# EAGLE design PayloadStandingV9 (EAGLE 9.2.0)
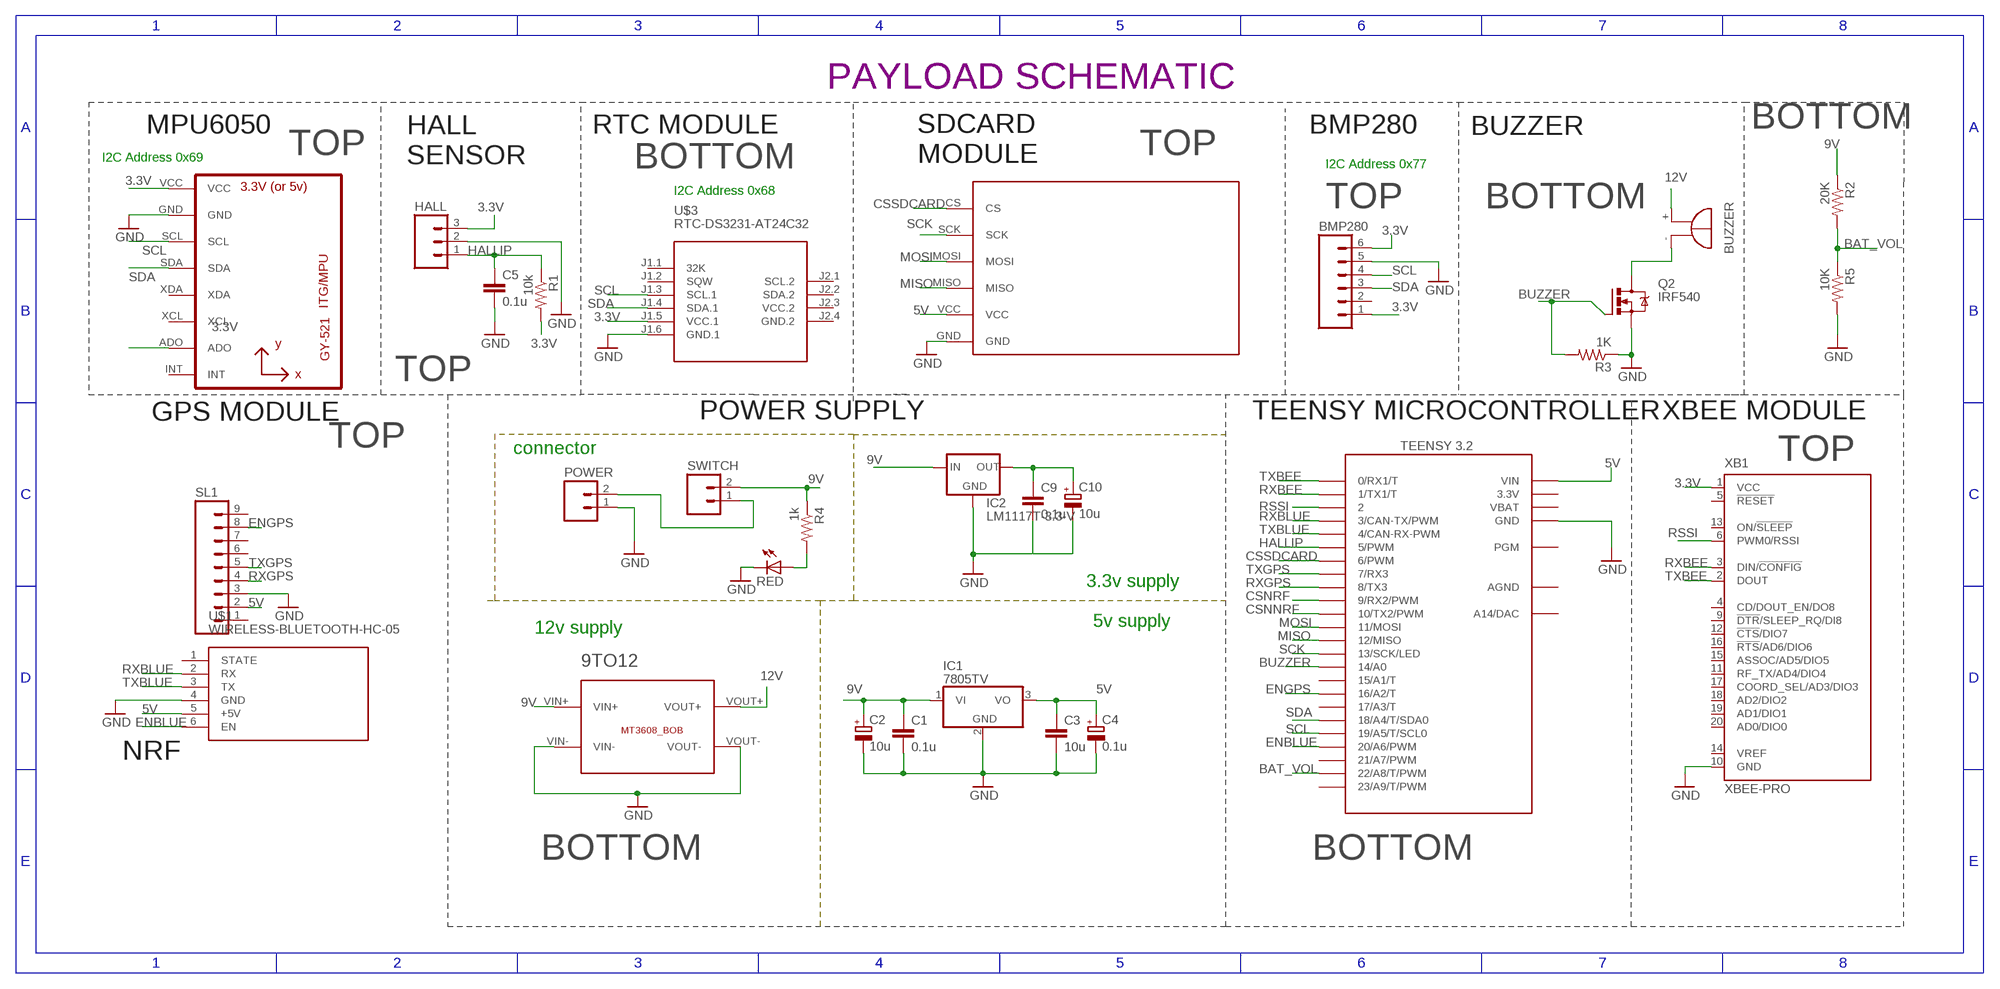
[diagram p0: schematic, sheet 1]

## Parts
9TO12  BREAKOUTS_MT3608_BOB  [BREAKOUTS_MT3608_BOB]
BMP280  M06  [06P]
C1  0.1u  C-EU025-025X050  [C025-025X050]
C2  10u  CPOL-EUE2.5-6  [E2,5-6]
C3  10u  C-EU025-025X050  [C025-025X050]
C4  0.1u  CPOL-EUE2.5-6  [E2,5-6]
C5  0.1u  C-EU025-025X050  [C025-025X050]
C9  0.1u  C-EU025-025X050  [C025-025X050]
C10  10u  CPOL-EUE2.5-6  [E2,5-6]
HALL  M03  [03P]
IC1  7805TV  [TO220V]
IC2  LM1117T-3.3-V  [TO220V]
POWER  CEDT_JANUARY_2015_V5_M02  [CEDT_JANUARY_2015_V5_02P]
Q2  IRF540  [TO220BV]
R1  10k  R-US_0204/7  [0204/7]
R2  20K  R-US_0204/7  [0204/7]
R3  1K  R-US_0204/7  [0204/7]
R4  1k  R-US_0204/7  [0204/7]
R5  10K  R-US_0204/7  [0204/7]
RED  red  LED3MM  [LED3MM]
SG1  BUZZER_EB2209A  [BUZZER_EB2209A]
SL1  M09  [09P]
SWITCH  M02  [02P]
U1  GY-521MPU6050  [GY-521]
U$1  WIRELESS-BLUETOOTH-HC-05  [WIRELESS-BLUETOOTH-HC-05]
U$2  TEENSY_3.1-3.2_OUTER_ROW  [TEENSY_3.0-3.2&LC_OUTER_ROW]
U$3  RTC-DS3231-AT24C32  [RTC-DS3231-AT24C32]
U$5  SDCARD  [M0SDCARDMODULE]
XB1  XBEE-PRO  [XBEE-PRO]

## Nets
3.3V [power]: BMP280.1 BMP280.6 C9.1 C10.+ HALL.3 IC2.2(OUT) R1.2 U1.ADO U1.VCC U$3.J1.5(VCC.1) XB1.1(VCC)
5V [power]: C3.1 C4.+ IC1.3(VO) SL1.2 U$1.5(+5V) U$2.VIN U$5.VCC
9V [power]: 9TO12.VIN+ C1.1 C2.+ IC1.1(VI) IC2.3(IN) R2.1 R4.1 SWITCH.2
12V [power]: 9TO12.VOUT+ SG1.+
BAT_VOL: R2.2 R5.1 U$2.22/A8(22/A8/T/PWM)
BUZZER: Q2.G R3.2 U$2.14/A0
CSNNRF: U$2.10(10/TX2/PWM)
CSNRF: U$2.9(9/RX2/PWM)
CSSDCARD: U$2.6(6/PWM) U$5.CS
ENBLUE: U$1.6(EN) U$2.20/A6(20/A6/PWM)
ENGPS: SL1.8 U$2.16/A2(16/A2/T)
GND [power]: 9TO12.VIN- 9TO12.VOUT- BMP280.5 C1.2 C2.- C3.2 C4.- C5.2 C9.2 C10.- HALL.2 IC1.2(GND) IC2.1(GND) POWER.1 Q2.S R3.1 R5.2 RED.K(C) SL1.3 U1.GND U$1.4(GND) U$2.GND U$2.GND1(GND) U$3.J1.6(GND.1) U$5.GND XB1.10(GND)
HALLIP: C5.1 HALL.1 R1.1 U$2.5(5/PWM)
MISO: U$2.12(12/MISO) U$5.MISO
MOSI: U$2.11(11/MOSI) U$5.MOSI
N$1 [power]: POWER.2 SWITCH.1
N$2: R4.2 RED.A
N$3 [power]: Q2.D SG1.-
RSSI: U$2.2 XB1.6(PWM0/RSSI)
RXBEE: U$2.1(1/TX1/T) XB1.3(DIN/!CONFIG)
RXBLUE: U$1.2(RX) U$2.3(3/CAN-TX/PWM)
RXGPS: SL1.4 U$2.8(8/TX3)
SCK: U$2.13(13/SCK/LED) U$5.SCK
SCL: BMP280.4 U1.SCL U$2.19/A5(19/A5/T/SCL0) U$3.J1.3(SCL.1)
SDA: BMP280.3 U1.SDA U$2.18/A4(18/A4/T/SDA0) U$3.J1.4(SDA.1)
TXBEE: U$2.0(0/RX1/T) XB1.2(DOUT)
TXBLUE: U$1.3(TX) U$2.4(4/CAN-RX-PWM)
TXGPS: SL1.5 U$2.7(7/RX3)
Unconnected: BMP280.2 SL1.1 SL1.6 SL1.7 SL1.9 U1.INT U1.XCL U1.XDA U$1.1(STATE) U$2.15/A1(15/A1/T) U$2.17/A3(17/A3/T) U$2.21/A7(21/A7/PWM) U$2.23/A9(23/A9/T/PWM) U$2.PGM U$2.RESET/DAC(A14/DAC) U$3.J1.1(32K) U$3.J1.2(SQW) U$3.J2.1(SCL.2) U$3.J2.2(SDA.2) XB1.4(CD/DOUT_EN/DO8) XB1.5(!RESET) XB1.9(!DTR!/SLEEP_RQ/DI8) XB1.11(RF_TX/AD4/DIO4) XB1.12(!CTS!/DIO7) XB1.13(ON/!SLEEP) XB1.14(VREF) XB1.15(ASSOC/AD5/DIO5) XB1.16(!RTS!/AD6/DIO6) XB1.17(COORD_SEL/AD3/DIO3) XB1.18(AD2/DIO2) XB1.19(AD1/DIO1) XB1.20(AD0/DIO0)

## Notes on the sheet
- PAYLOAD SCHEMATIC
- MPU6050 | RTC MODULE | BMP280 | BUZZER | BOTTOM
- TOP | TOP
- I2C Address 0x69
- SDCARD
  MODULE
- HALL
  SENSOR
- BOTTOM | I2C Address 0x77
- I2C Address 0x68
- TOP | BOTTOM
- TOP
- GPS MODULE | POWER SUPPLY | TEENSY MICROCONTROLLER | XBEE MODULE
- TOP
- connector
- TOP
- 3.3v supply
- 5v supply
- 12v supply
- NRF
- BOTTOM | BOTTOM

## Power pins joined to a net without a drawn wire
3.3V: U$2.3.3V U$2.3.3V1(3.3V)
AGND: U$2.AGND
GND.2: U$3.J2.4(GND.2)
VBAT: U$2.VBAT
VCC.2: U$3.J2.3(VCC.2)

## Library data of the parts
9TO12 = Cansat2019_3279_Container_v01:BREAKOUTS_MT3608_BOB
BMP280 = con-amp-quick:M06: AMP QUICK CONNECTOR; OC_FARNELL: unknown; OC_NEWARK: unknown
C1 C3 C5 C9 = resistor:C-EU: CAPACITOR, European symbol
C2 C4 C10 = rcl:CPOL-EU: POLARIZED CAPACITOR, European symbol; SPICEPREFIX: C
HALL = con-amp-quick:M03: AMP QUICK CONNECTOR; OC_FARNELL: unknown; OC_NEWARK: unknown
IC1 = linear:78*: Positive VOLTAGE REGULATOR Source: http://cache.national.com/ds/LM/LM78L05.pdf http://www.fairchildsemi.com/ds/LM/LM7805.pdf
IC2 = lm1117:LM1117T-*
POWER = Cansat2019_3279_Container_v01:CEDT_JANUARY_2015_V5_M02: AMP QUICK CONNECTOR
Q2 = transistor-power:IRF540: HEXFET Power MOSFET
R1-R5 = rcl:R-US_: RESISTOR, American symbol; SPICEPREFIX: R
RED = CEDT_JANUARY_2015_v5:LED
SG1 = Cansat2019_3279_Container_v01:BUZZER_EB2209A: BUZZER Source: Buerklin; OC_FARNELL: unknown; OC_NEWARK: unknown
SL1 = con-amp-quick:M09: AMP QUICK CONNECTOR; OC_FARNELL: unknown; OC_NEWARK: unknown
SWITCH = CEDT_JANUARY_2015_v5:M02: AMP QUICK CONNECTOR
U1 = gy-521:GY-521
U$1 = diy-modules(1):WIRELESS-BLUETOOTH-HC-05: Bluetooth Transceiver Module based on HC-05 board Tutorial is available here: https://arduino-info.wikispaces.com/BlueTooth-HC05-HC06-Modules-How-To Click here to find device on ebay.com <http://www.ebay.com/sch/hc-05+module+rs232>
U$2 = Teensy_3_and_LC_Series_Boards_v1.4:TEENSY_3.1-3.2_OUTER_ROW: Footprint for Teensy 3.1 or 3.2 board using all pin connections on the outer perimeter
U$3 = diy-modules:RTC-DS3231-AT24C32: RTC Module with Battery and EEPROM based on DS3231 and AT24C32 chips Tutorial can be found here: https://edwardmallon.wordpress.com/2014/05/21/using-a-cheap-3-ds3231-rtc-at24c32-eeprom-from-ebay/ Click here to find device on ebay.com <http://www.ebay.com/sch/DS3231+AT24C32+module>
U$5 = mylib:SDCARD
XB1 = maxstream:XBEE: XBee (TM) /XBee-PRO(TM) OEM RF Modules Source: MaxStream, Inc. xbee_productmanual.pdf; MPN: XBP24-AWI-001; OC_FARNELL: 1337916; OC_NEWARK: 42M2667

## Net classes
0 default: width 0.406 mm
1 power: width 0.61 mm

## Board
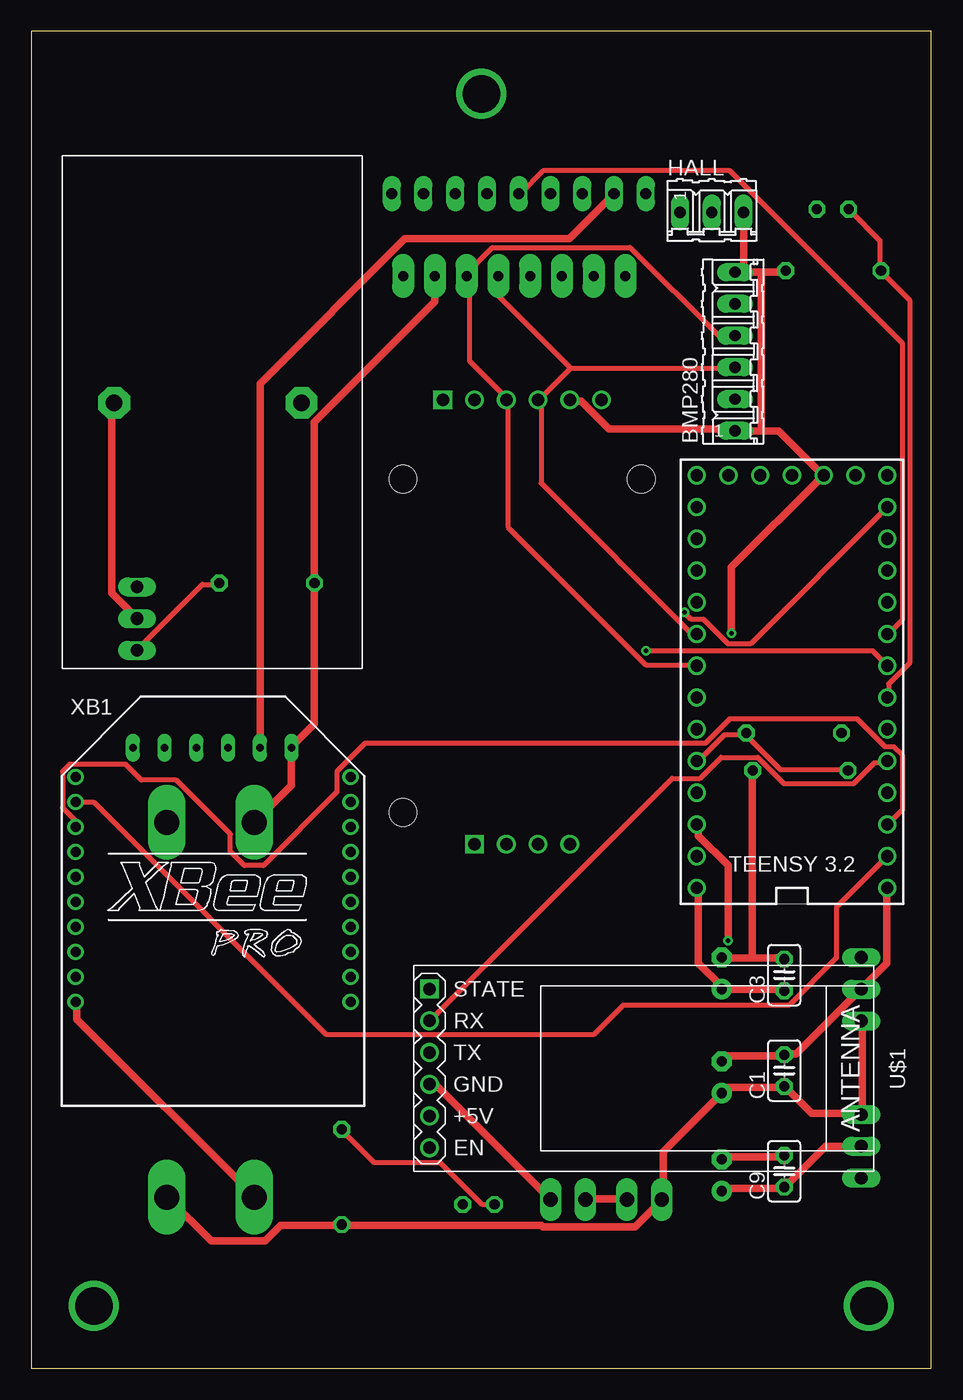
[diagram p1: board, top side]
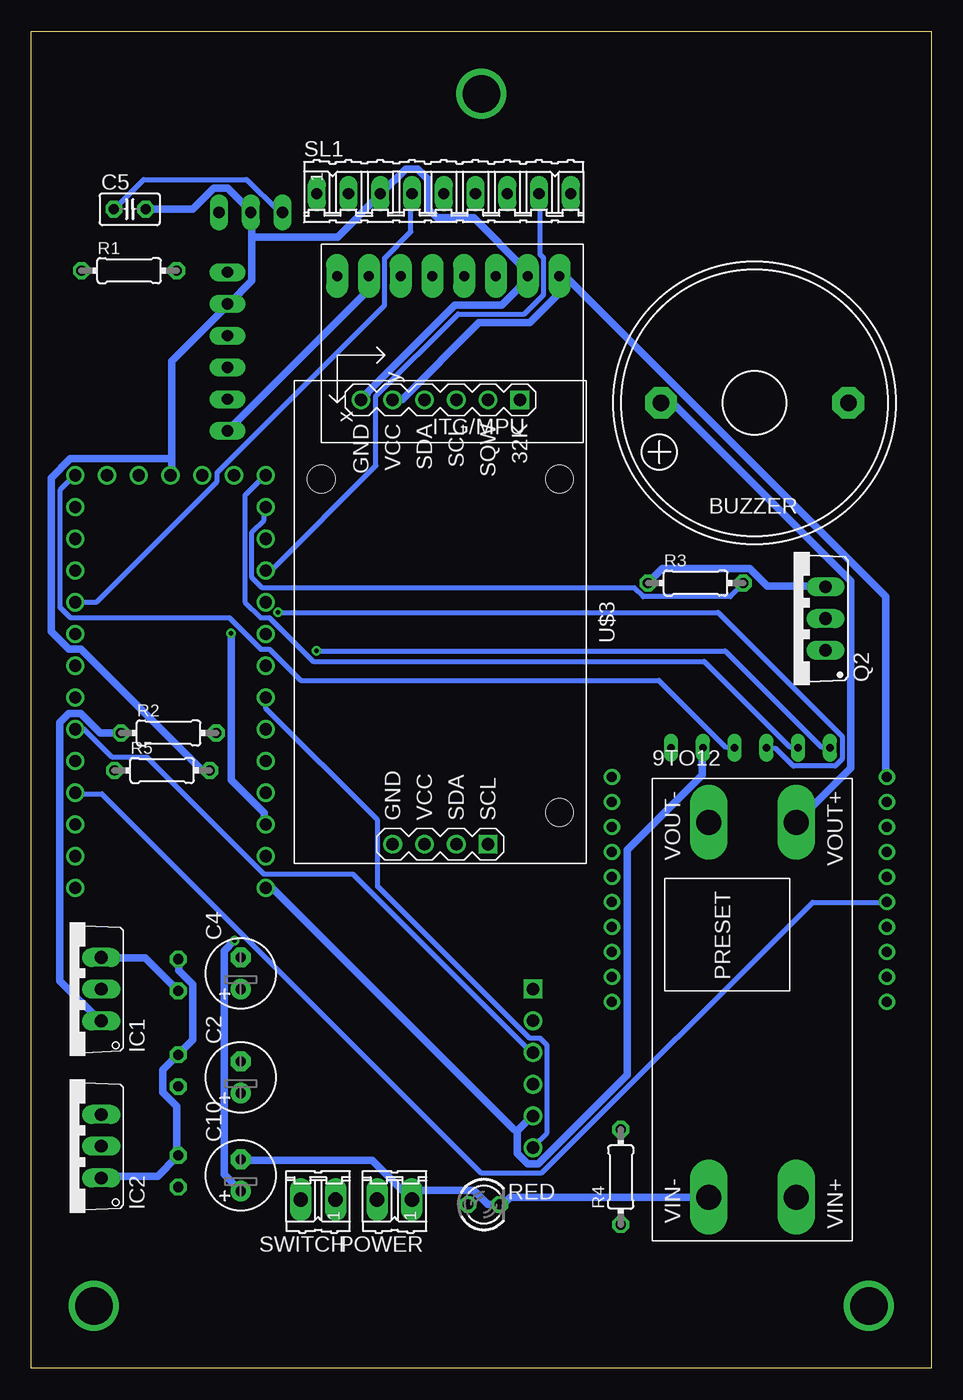
[diagram p2: board, bottom side, seen from below]

Size 72 x 107 mm. Coordinates in mm from the lower left corner, seen from the top.
Outline: 0,0 72,0 72,107 0,107 0,0
Copper layers (1*16): Top 0.035mm / dielectric 1.5mm / Bottom 0.035mm
Design rules "default": minimum track width 6mil, minimum drill 0.35mm, track to track 6mil, track to pad 6mil, pad to pad 6mil, via to via 6mil, smd to smd 6mil, copper to edge 40mil, drill to drill 6mil, minimum pad ring 10mil, minimum via ring 8mil, stop-mask expansion 4mil, vias tented up to drill 0mil, thermal gap 10mil

### Footprints (pad centres in the part's own frame; a part is rotated, then mirrored left to right if it is on the bottom)
BREAKOUTS_MT3608_BOB = drill 2 pad 3 long: VIN+ 33.5,-4.5; VIN- 33.5,-11.5; VOUT+ 3.5,-4.5; VOUT- 3.5,-11.5
06P = drill 0.914 long: 1 -6.35,0; 2 -3.81,0; 3 -1.27,0; 4 1.27,0; 5 3.81,0; 6 6.35,0
C025-025X050 = drill 0.813 octagon: 1 -1.27,0; 2 1.27,0
E2,5-6 = drill 0.813 pad 1.6: + -1.27,0 | drill 0.813 pad 1.6 octagon: - 1.27,0
03P = drill 0.914 long: 1 -2.54,0; 2 0,0; 3 2.54,0
TO220V = drill 1.016 long: 1 -2.54,-2.54; 2 0,-2.54; 3 2.54,-2.54
CEDT_JANUARY_2015_V5_02P = drill 1.143 long: 1 -1.397,0; 2 1.397,0
TO220BV = drill 1.016 long: D 0,-2.54; G -2.54,-2.54; S 2.54,-2.54
0204/7 = drill 0.813 octagon: 1 -3.81,0; 2 3.81,0
LED3MM = drill 0.813 octagon: A -1.27,0; K 1.27,0
BUZZER_EB2209A = drill 1.321 pad 2.54 octagon: + 7.493,0; - -7.493,0
09P = drill 0.914 long: 1 -10.16,0; 2 -7.62,0; 3 -5.08,0; 4 -2.54,0; 5 0,0; 6 2.54,0; 7 5.08,0; 8 7.62,0; 9 10.16,0
02P = drill 1.143 long: 1 -1.397,0; 2 1.397,0
GY-521 = drill 0.8 pad 1.778 long: ADO -8.89,-6.35; GND -8.89,6.35; INT -8.89,-8.89; SCL -8.89,3.81; SDA -8.89,1.27; VCC -8.89,8.89; XCL -8.89,-3.81; XDA -8.89,-1.27
WIRELESS-BLUETOOTH-HC-05 = drill 1 square: 1 -6.35,-17.145 | drill 1: 2 -3.81,-17.145; 3 -1.27,-17.145; 4 1.27,-17.145; 5 3.81,-17.145; 6 6.35,-17.145
TEENSY_3.0-3.2&LC_OUTER_ROW = drill 0.965: 0 -7.62,13.97; 1 -7.62,11.43; 2 -7.62,8.89; 3 -7.62,6.35; 3.3V 7.62,11.43; 3.3V1 -2.54,-16.51; 4 -7.62,3.81; 5 -7.62,1.27; 6 -7.62,-1.27; 7 -7.62,-3.81; 8 -7.62,-6.35; 9 -7.62,-8.89; 10 -7.62,-11.43; 11 -7.62,-13.97; 12 -7.62,-16.51; 13 7.62,-16.51; 14/A0 7.62,-13.97; 15/A1 7.62,-11.43; 16/A2 7.62,-8.89; 17/A3 7.62,-6.35; 18/A4 7.62,-3.81; 19/A5 7.62,-1.27; 20/A6 7.62,1.27; 21/A7 7.62,3.81; 22/A8 7.62,6.35; 23/A9 7.62,8.89; AGND 7.62,13.97; GND -7.62,16.51; GND1 0,-16.51; PGM 2.54,-16.51; RESET/DAC 5.08,-16.51; VBAT -5.08,-16.51; VIN 7.62,16.51
RTC-DS3231-AT24C32 = drill 1 square: J1.1 -17.78,6.35; J2.1 17.78,3.81 | drill 1: J1.2 -17.78,3.81; J1.3 -17.78,1.27; J1.4 -17.78,-1.27; J1.5 -17.78,-3.81; J1.6 -17.78,-6.35; J2.2 17.78,1.27; J2.3 17.78,-1.27; J2.4 17.78,-3.81 | hole 2.2: -11.43,-9.525; -11.43,9.525; 15.24,9.525
M0SDCARDMODULE = drill 0.6 long: CS -6.35,6.35; GND -6.35,-6.35; MISO -6.35,-1.27; MOSI -6.35,1.27; SCK -6.35,3.81; VCC -6.35,-3.81
XBEE-PRO = drill 0.8 pad 1.27: 1 -11,9; 2 -11,7; 3 -11,5; 4 -11,3; 5 -11,1; 6 -11,-1; 7 -11,-3; 8 -11,-5; 9 -11,-7; 10 -11,-9; 11 11,-9; 12 11,-7; 13 11,-5; 14 11,-3; 15 11,-1; 16 11,1; 17 11,3; 18 11,5; 19 11,7; 20 11,9

### Placement (x,y rotation side)
9TO12  6.32,47.2 270 bottom
BMP280  56.29,81.37 90 top
C1  60.24,23.82 90 top
C2  55.24,23.29 90 bottom
C3  60.24,31.47 90 top
C4  55.24,31.61 90 bottom
C5  64.12,92.76 0 bottom
C9  60.24,15.77 90 top
C10  55.24,15.45 90 bottom
HALL  54.44,92.49 0 top
IC1  68.94,30.34 90 bottom
IC2  68.94,17.77 90 bottom
POWER  42.94,13.51 180 bottom
Q2  11,60 90 bottom
R1  64.17,87.84 0 bottom
R2  61.01,50.84 0 bottom
R3  18.85,62.84 0 bottom
R4  24.84,15.31 90 bottom
R5  61.53,47.84 0 bottom
RED  35.79,13.11 0 bottom
SG1  14.13,77.26 180 bottom
SL1  39,94 0 bottom
SWITCH  49.05,13.51 180 bottom
U1  38.64,78.53 270 bottom
U$1  49,24 270 top
U$2  60.86,54.95 180 top
U$3  39.27,59.72 270 bottom
U$5  14.47,56.02 90 top
XB1  14.55,38.32 0 top

### Tracks (layer width: path | path; a pad name or v marks a point on that pad's centre or on a via)
3.3V  (via drill 0.35)
  Top 0.61: C10.+ 55.32,14.25 55.46,14.39 60.21,14.39 C9.1 60.49,14.67 63.56,17.74 66.36,17.74 IC2.2 | v55.74,34.23 55.74,40.23 53.37,42.61 53.37,43.45 U$2.3.3V | 58.4,87.73 56.3,87.73 BMP280.6 57,88.01 57,92.48 HALL.3 | 58.4,87.73 60.35,87.73 R1.2 | 58.4,75.02 59.79,75.02 63.28,71.53 U$2.3.3V1 63.14,71.25 56.02,64.12 v56.02,58.81 | 58.4,75.02 BMP280.1 56.02,75.16 46.24,75.16 44.01,77.39 43.17,77.39 U$3.J1.5 | 58.4,75.02 58.4,87.73
  Bottom 0.61: v55.74,34.23 56.58,33.39 56.58,15.51 55.32,14.25 C10.+ | U1.ADO 45.12,87.31 45.12,86.19 56.16,75.16 BMP280.1 | XB1.1 3.63,47.36 3.63,61.75 29.2,87.31 29.62,87.31 U1.VCC 29.06,86.75 32.13,83.68 36.18,83.68 42.33,77.53 43.03,77.53 U$3.J1.5 | v56.02,58.81 56.02,47.08 53.37,44.42 53.37,43.59 U$2.3.3V
5V
  Top 0.61: C3.1 60.21,30.32 55.32,30.32 C4.+ 55.18,30.59 53.37,32.41 53.37,38.42 U$2.VIN | SL1.2 46.52,93.88 43.03,90.39 29.9,90.39 18.3,78.79 18.3,49.73 U$5.VCC
  Bottom 0.61: IC1.3 66.36,32.83 62.87,32.83 60.35,30.32 C3.1 | 33.11,19 33.11,17.18 32.27,16.34 31.43,16.34 24.31,23.47 24.31,41.49 18.3,47.5 18.3,49.59 U$5.VCC | 33.11,19 31.99,20.12 U$1.5 | U$2.VIN 53.23,38.42 52.67,38.42 33.39,19.14 33.11,19
9V
  Top 0.61: 9TO12.VIN+ 10.9,13.69 14.39,10.2 18.72,10.2 19.98,11.46 24.73,11.46 R4.1 25.15,11.46 40.79,11.46 40.93,11.32 48.34,11.32 50.29,13.27 SWITCH.2 50.57,13.55 50.57,17.32 55.04,21.79 C2.+ 55.32,22.07 55.74,22.49 60.21,22.49 C1.1 60.49,22.35 62.45,20.4 66.36,20.4 IC2.3 66.5,20.68 66.5,27.66 IC1.1
  Bottom 0.61: R2.1 66.5,50.85 68.03,52.39 69.01,52.39 69.71,51.69 69.71,31.01 66.5,27.8 IC1.1
12V
  Bottom 0.61: SG1.+ 21.51,77.25 20.68,77.25 6.43,63.01 6.43,48.06 10.76,43.73 9TO12.VOUT+
BAT_VOL
  Top 0.406: U$2.22/A8 53.37,48.62 55.46,50.71 57.14,50.71 R2.2 57.28,50.57 59.93,47.92 65.24,47.92 R5.1
BUZZER
  Top 0.406: R3.2 14.95,62.73 13.69,62.73 8.52,57.56 Q2.G
  Bottom 0.406: U$2.14/A0 53.37,68.87 53.37,67.89 54.34,66.92 54.34,63.28 53.51,62.45 23.75,62.45 23.05,61.75 16.07,61.75 15.09,62.73 R3.2
CSSDCARD  (via drill 0.35)
  Top 0.406: v49.17,57.42 67.33,57.42 68.45,56.3 U$2.6
  Bottom 0.406: v49.17,57.42 16.48,57.42 8.8,49.73 8.24,49.73 U$5.CS
ENBLUE
  Bottom 0.406: U$2.20/A6 53.23,53.65 53.23,52.81 44.28,43.87 44.28,38.56 32.13,26.4 31.29,26.4 30.73,25.84 30.73,18.86 31.85,17.74 U$1.6
ENGPS
  Bottom 0.406: SL1.8 31.29,93.88 31.29,89.13 31.01,88.85 31.01,85.92 32.55,84.38 37.86,84.38 44.42,77.81 44.42,72.22 52.81,63.84 53.23,63.84 U$2.16/A2
GND
  Top 0.61: XB1.10 3.63,29.2 3.63,27.94 17.74,13.83 9TO12.VIN- | 57.7,32.83 55.32,32.83 C4.- | 57.7,32.83 60.21,32.83 C3.2 | 57.7,32.83 57.7,47.78 R5.2 | U$1.4 31.99,22.63 32.41,22.63 41.49,13.55 POWER.1 | C9.2 60.21,16.9 55.46,16.9 55.32,16.76 C10.- | C2.- 55.32,24.59 55.74,25.01 60.21,25.01 C1.2 60.49,25.15 61.19,25.15 66.22,30.18 IC1.2 66.5,30.45 68.45,32.41 68.45,38.42 U$2.GND | 9TO12.VOUT- 17.88,43.73 20.82,46.66 20.82,49.59 U$5.GND 20.95,49.87 22.63,51.55 22.63,62.73 R3.1 22.63,63.14 22.63,75.72 32.27,85.36 32.27,87.31 U1.GND
  Bottom 0.61: IC2.1 66.36,15.37 61.89,15.37 60.35,16.9 C9.2 60.35,17.32 60.35,20.95 61.47,22.07 61.47,23.89 60.35,25.01 C1.2 60.07,25.29 59.09,26.26 59.09,30.73 60.21,31.85 60.21,32.69 C3.2 | C10.- 55.18,16.62 44.7,16.62 41.77,13.69 POWER.1 41.49,13.55 40.79,14.25 36.6,14.25 35.48,13.13 34.65,13.13 RED.K 34.23,13.13 33.67,13.69 17.88,13.69 9TO12.VIN- | Q2.S 8.52,62.59 13.13,62.59 14.53,63.98 21.51,63.98 22.63,62.87 R3.1 | U$3.J1.6 45.54,77.53 45.12,77.95 45.12,78.09 38.14,85.08 34.37,85.08 32.41,87.03 32.41,87.31 U1.GND 32.55,87.59 32.55,88.01 36.6,92.06 39.53,92.06 40.23,92.76 40.23,95.14 41.07,95.97 42.05,95.97 43.87,94.16 SL1.3 44.15,93.88 47.5,90.53 54.34,90.53 | C5.2 62.73,92.76 59.09,92.76 57.42,94.44 56.3,94.44 54.48,92.62 HALL.2 54.34,92.2 54.34,90.53 | 54.34,90.53 54.34,87.03 56.16,85.22 BMP280.5 56.44,84.94 60.77,80.61 60.77,72.78 | 60.77,72.78 60.77,71.53 U$2.GND1 | 60.77,72.78 68.87,72.78 70.41,71.25 70.41,58.95 69.01,57.56 68.03,57.56 58.4,47.92 57.84,47.92 R5.2
HALLIP
  Top 0.406: C5.1 65.52,92.62 67.89,90.25 67.89,87.87 R1.1 68.03,87.73 70.27,85.5 70.27,56.44 68.59,54.76 68.59,53.78 U$2.5
  Bottom 0.406: HALL.1 51.97,92.62 52.25,92.62 54.76,95.14 63.01,95.14 C5.1
MISO
  Bottom 0.406: U$5.MISO 15.79,49.73 16.48,49.73 21.79,55.04 50.43,55.04 52.95,57.56 53.65,57.56 56.16,60.07 68.87,60.07 69.71,60.91 69.71,70.27 68.59,71.39 U$2.12
MOSI  (via drill 0.35)
  Top 0.406: v52.25,60.49 52.81,59.93 53.78,59.93 55.74,57.98 57.56,57.98 68.45,68.87 U$2.11
  Bottom 0.406: v52.25,60.49 17.04,60.49 7.12,50.57 7.12,48.76 7.68,48.2 11.04,48.2 12.43,49.59 13.13,49.59 U$5.MOSI
N$1
  Top 0.61: POWER.2 44.42,13.55 47.64,13.55 SWITCH.1
N$2
  Top 0.406: RED.A 37.02,13.13 36.04,13.13 32.69,16.48 27.38,16.48 24.87,19 R4.2
N$3
  Top 0.61: Q2.D 8.38,60.07 6.43,62.03 6.43,77.11 6.57,77.25 SG1.-
N$4  (via drill 3)
  other vias: 67,5
N$5  (via drill 3)
  other vias: 5,5
N$6  (via drill 3)
  other vias: 36,102
RSSI
  Bottom 0.406: XB1.6 3.63,37.3 9.5,37.3 31.15,15.65 36.04,15.65 66.36,45.96 68.45,45.96 U$2.2
RXBEE
  Top 0.406: XB1.3 3.49,43.45 3.49,43.87 2.52,44.84 2.52,47.78 3.07,48.34 7.54,48.34 8.8,47.08 11.6,47.08 15.93,42.75 15.93,41.35 17.04,40.23 18.58,40.23 24.45,46.1 24.45,47.78 26.68,50.01 53.92,50.01 55.88,51.97 66.08,51.97 68.31,49.73 69.01,49.73 69.71,49.03 69.71,44.7 68.59,43.59 U$2.1
RXBLUE
  Top 0.406: U$2.3 68.45,48.48 67.47,48.48 65.8,46.8 60.21,46.8 58.12,48.9 55.18,48.9 53.51,47.22 51.27,47.22 31.99,27.94 U$1.2
RXGPS
  Bottom 0.406: SL1.4 41.63,93.88 41.63,90.94 43.73,88.85 43.73,85.08 57.14,71.67 57.14,70.97 66.78,61.33 68.45,61.33 U$2.8
SCK
  Bottom 0.406: U$5.SCK 10.76,49.73 11.32,49.73 18.16,56.58 49.45,56.58 52.95,60.07 53.65,60.07 54.9,61.33 54.9,69.85 53.37,71.39 U$2.13
SCL
  Top 0.406: BMP280.4 56.16,82.7 54.9,82.7 47.92,89.69 36.88,89.69 34.92,87.73 34.92,87.45 U1.SCL 35.06,87.31 35.06,80.61 38,77.67 U$3.J1.3 38.14,77.39 38.14,67.33 49.17,56.3 53.23,56.3 U$2.19/A5
SDA
  Top 0.406: 43.17,80.05 56.16,80.05 BMP280.3 | 43.17,80.05 40.65,77.53 U$3.J1.4 40.79,77.39 40.79,70.83 52.81,58.81 53.23,58.81 U$2.18/A4 | 43.17,80.05 37.44,85.78 37.44,87.31 U1.SDA
TXBEE
  Top 0.406: XB1.2 3.63,45.26 5.03,45.26 23.61,26.68 44.98,26.68 47.36,29.06 60.63,29.06 64.4,32.83 64.4,36.88 68.45,40.93 U$2.0
TXBLUE
  Bottom 0.406: U$2.4 68.45,51.13 67.75,51.13 65.52,48.9 62.73,48.9 53.37,39.53 46.24,39.53 31.99,25.29 U$1.3
TXGPS
  Top 0.406: SL1.5 39.12,94.02 40.93,95.83 55.88,95.83 69.71,82 69.71,59.93 68.59,58.81 U$2.7